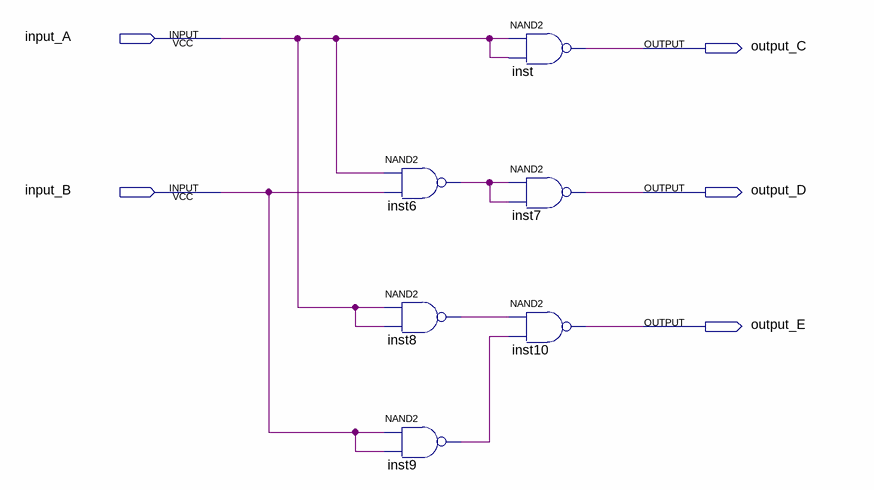
[diagram p0: schematic sheet]
// Quartus schematic nand_schematic.bdf as structural Verilog: 6 symbols, 5 pins
module nand_schematic (
  input  input_A,
  input  input_B,
  output output_C,
  output output_D,
  output output_E
);

  wire inst6_out, inst8_out, inst9_out;

  nand inst6 (inst6_out, input_A, input_B);
  nand inst8 (inst8_out, input_A, input_A);
  nand inst9 (inst9_out, input_B, input_B);
  nand inst (output_C, input_A, input_A);
  nand inst7 (output_D, inst6_out, inst6_out);
  nand inst10 (output_E, inst8_out, inst9_out);
endmodule
